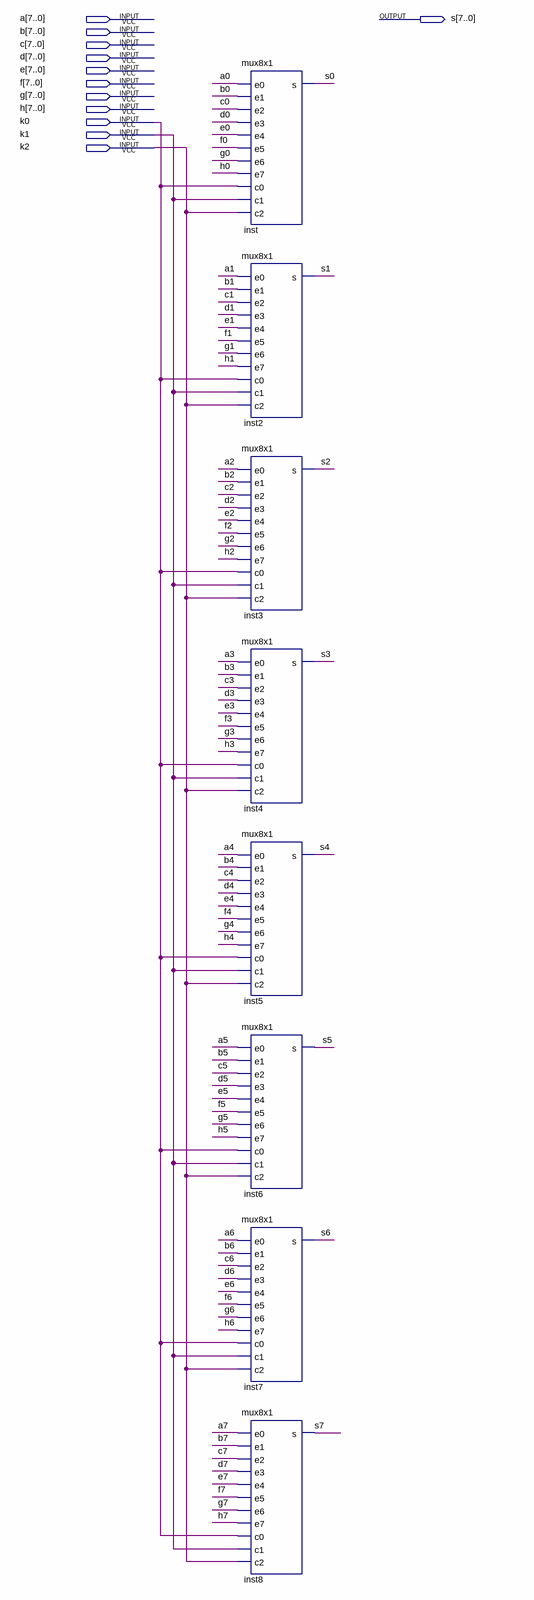
[diagram p0: schematic sheet]
// Quartus schematic mux8x1_8bits.bdf as structural Verilog: 8 symbols, 12 pins
module mux8x1_8bits (
  input  [7:0] a,
  input  [7:0] b,
  input  [7:0] c,
  input  [7:0] d,
  input  [7:0] e,
  input  [7:0] f,
  input  [7:0] g,
  input  [7:0] h,
  input  k0,
  input  k1,
  input  k2,
  output [7:0] s
);

  mux8x1 inst (
    .e0(a[0]), .e1(b[0]), .e2(c[0]), .e3(d[0]), .e4(e[0]), .e5(f[0]), .e6(g[0]), .e7(h[0]), .c0(k0), .c1(k1),
    .c2(k2), .s(s[0]));
  mux8x1 inst2 (
    .e0(a[1]), .e1(b[1]), .e2(c[1]), .e3(d[1]), .e4(e[1]), .e5(f[1]), .e6(g[1]), .e7(h[1]), .c0(k0), .c1(k1),
    .c2(k2), .s(s[1]));
  mux8x1 inst3 (
    .e0(a[2]), .e1(b[2]), .e2(c[2]), .e3(d[2]), .e4(e[2]), .e5(f[2]), .e6(g[2]), .e7(h[2]), .c0(k0), .c1(k1),
    .c2(k2), .s(s[2]));
  mux8x1 inst4 (
    .e0(a[3]), .e1(b[3]), .e2(c[3]), .e3(d[3]), .e4(e[3]), .e5(f[3]), .e6(g[3]), .e7(h[3]), .c0(k0), .c1(k1),
    .c2(k2), .s(s[3]));
  mux8x1 inst5 (
    .e0(a[4]), .e1(b[4]), .e2(c[4]), .e3(d[4]), .e4(e[4]), .e5(f[4]), .e6(g[4]), .e7(h[4]), .c0(k0), .c1(k1),
    .c2(k2), .s(s[4]));
  mux8x1 inst6 (
    .e0(a[5]), .e1(b[5]), .e2(c[5]), .e3(d[5]), .e4(e[5]), .e5(f[5]), .e6(g[5]), .e7(h[5]), .c0(k0), .c1(k1),
    .c2(k2), .s(s[5]));
  mux8x1 inst7 (
    .e0(a[6]), .e1(b[6]), .e2(c[6]), .e3(d[6]), .e4(e[6]), .e5(f[6]), .e6(g[6]), .e7(h[6]), .c0(k0), .c1(k1),
    .c2(k2), .s(s[6]));
  mux8x1 inst8 (
    .e0(a[7]), .e1(b[7]), .e2(c[7]), .e3(d[7]), .e4(e[7]), .e5(f[7]), .e6(g[7]), .e7(h[7]), .c0(k0), .c1(k1),
    .c2(k2), .s(s[7]));
endmodule
